# Altium schematic sheet Secondary Protection.SchDoc
size C
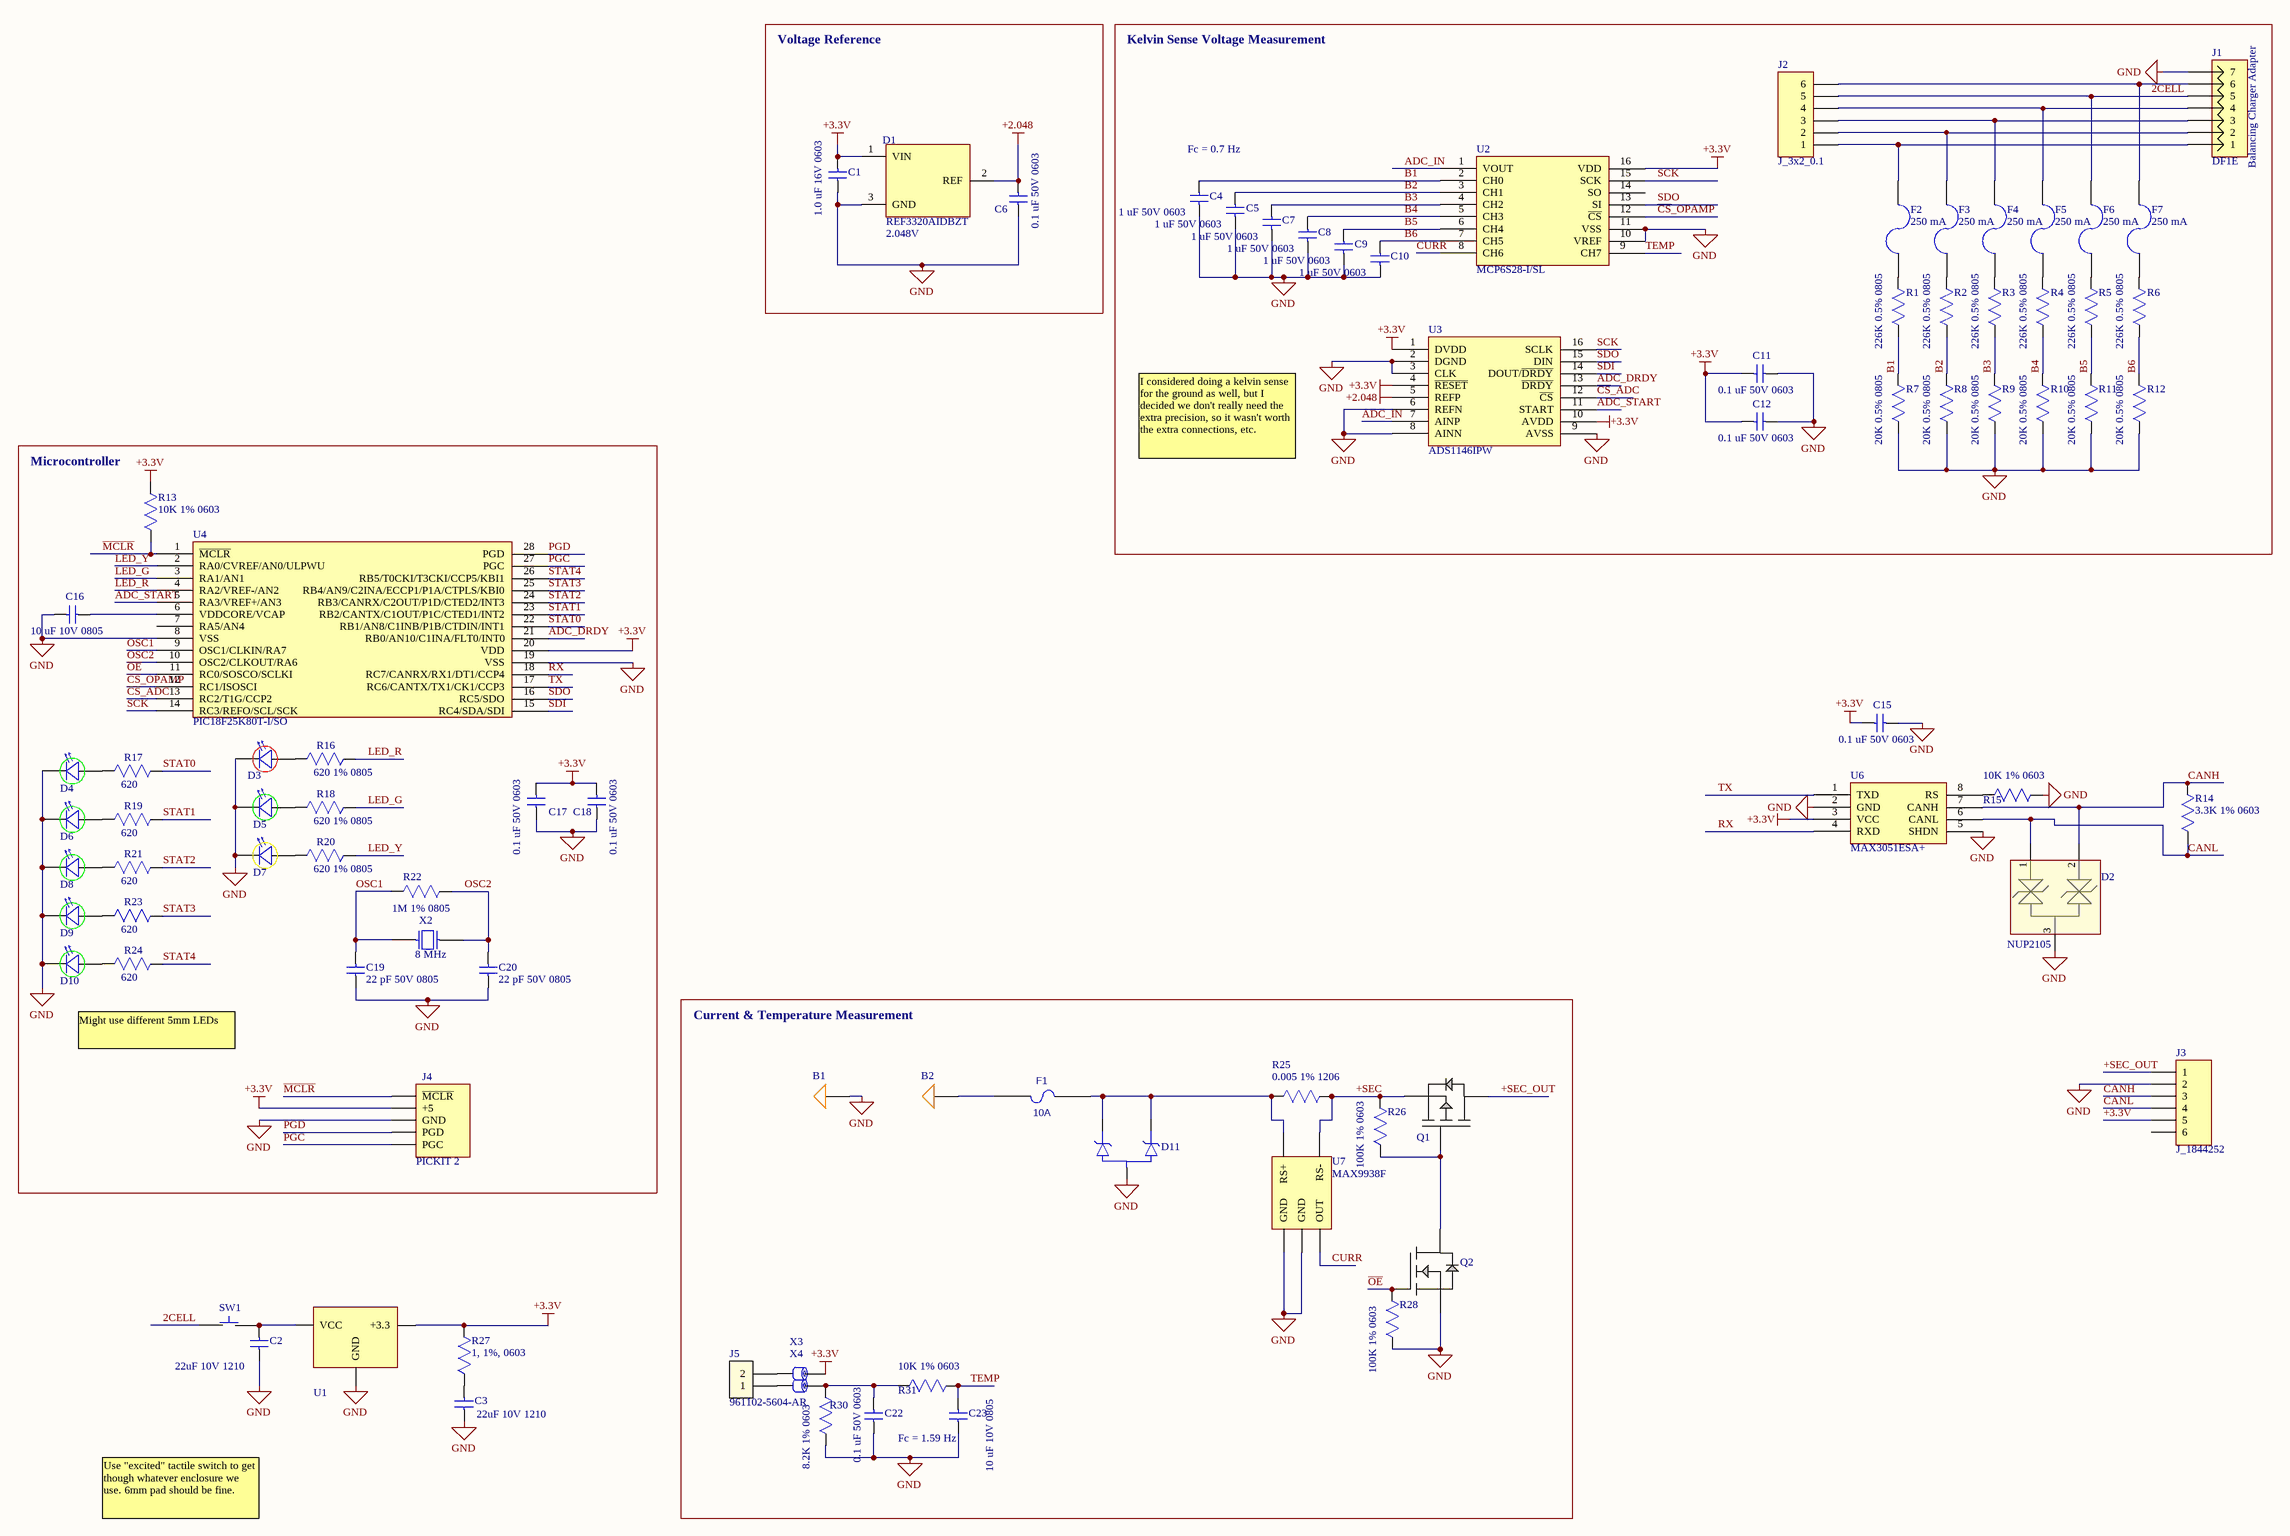
[diagram p0: Secondary Protection.SchDoc]

## Parts
B1  J_C3_BATTERY_PAD  [BatteryPad]  (value not drawn)
B2  J_C3_BATTERY_PAD  [BatteryPad]  (value not drawn)
C1  value 1.0 uF 16V 0603  [0603_cap]  (hidden comment: CAP 0603)
C2  value 22uF 10V 1210  [1210_Capacitor]  (hidden comment: CAP 1210)
C3  value 22uF 10V 1210  [1210_Capacitor]  (hidden comment: CAP 1210)
C4  value 1 uF 50V 0603  [0603_cap]  (hidden comment: CAP 0603)
C5  value 1 uF 50V 0603  [0603_cap]  (hidden comment: CAP 0603)
C6  value 0.1 uF 50V 0603  [0603_cap]  (hidden comment: CAP 0603)
C7  value 1 uF 50V 0603  [0603_cap]  (hidden comment: CAP 0603)
C8  value 1 uF 50V 0603  [0603_cap]  (hidden comment: CAP 0603)
C9  value 1 uF 50V 0603  [0603_cap]  (hidden comment: CAP 0603)
C10  value 1 uF 50V 0603  [0603_cap]  (hidden comment: CAP 0603)
C11  value 0.1 uF 50V 0603  [0603_cap]  (hidden comment: CAP 0603)
C12  value 0.1 uF 50V 0603  [0603_cap]  (hidden comment: CAP 0603)
C15  value 0.1 uF 50V 0603  [0603_cap]  (hidden comment: CAP 0603)
C16  value 10 uF 10V 0805  [0805_Capacitor]  (hidden comment: CAP 0805)
C17  value 0.1 uF 50V 0603  [0603_cap]  (hidden comment: CAP 0603)
C18  value 0.1 uF 50V 0603  [0603_cap]  (hidden comment: CAP 0603)
C19  value 22 pF 50V 0805  [0805_Capacitor]  (hidden comment: CAP 0805)
C20  value 22 pF 50V 0805  [0805_Capacitor]  (hidden comment: CAP 0805)
C22  value 0.1 uF 50V 0603  [0603_cap]  (hidden comment: CAP 0603)
C23  value 10 uF 10V 0805  [0805_Capacitor]  (hidden comment: CAP 0805)
D1  value 2.048V  Manufacturer PN: REF3320AIDBZT  [SOT-23]  (hidden comment: IC LDO V-REF 2.048V SOT23-3)
D2  Manufacturer PN: NUP2105  [SOT-23]  (hidden comment: CAN TVS)
D3  D_LED_0805_RED  [0805P_RED]  (value not drawn)
D4  D_LED_5MM_GREEN  [LED_5mm_GREEN]  (value not drawn)
D5  D_LED_0805_GREEN  [0805P_Green]  (value not drawn)
D6  D_LED_5MM_GREEN  [LED_5mm_GREEN]  (value not drawn)
D7  D_LED_0805_YELLOW  [0805P_YELLOW]  (value not drawn)
D8  D_LED_5MM_GREEN  [LED_5mm_GREEN]  (value not drawn)
D9  D_LED_5MM_GREEN  [LED_5mm_GREEN]  (value not drawn)
D10  D_LED_5MM_GREEN  [LED_5mm_GREEN]  (value not drawn)
D11  D_AZ23C36-TP  [SOT-23]  (value not drawn)
F1  value 10A  [FUSEHOLDER - AutoBlade]  (hidden comment: PWR - ATO 20A)
F2  250 mA  [1206_RESISTOR]
F3  250 mA  [1206_RESISTOR]
F4  250 mA  [1206_RESISTOR]
F5  250 mA  [1206_RESISTOR]
F6  250 mA  [1206_RESISTOR]
F7  250 mA  [1206_RESISTOR]
J1  value DF1E  [DF1EC-7P-2.5DSA]  (hidden comment: DF1E 5-pin Male Header)
J2  J_3x2_0.1  [6PIN_2_.100IN]
J3  J_1844252  [1844252]
J4  value PICKIT 2  [CONN FEMALE 5POS .100" R/A GOLD]  (hidden comment: J_PICKIT2_5)
J5  Manufacturer PN: 961102-5604-AR  [SIP_HEADER_2]  (hidden comment: J_Thermistor_Connector)
Q1  MOSFET P-CH 30V 25A TO-252  [DPAK]  (value not drawn)
Q2  RK7002BT116  [SOT-23]  (value not drawn)
R1  value 226K 0.5% 0805  [0805_Resistor]  (hidden comment: RES 0805)
R2  value 226K 0.5% 0805  [0805_Resistor]  (hidden comment: RES 0805)
R3  value 226K 0.5% 0805  [0805_Resistor]  (hidden comment: RES 0805)
R4  value 226K 0.5% 0805  [0805_Resistor]  (hidden comment: RES 0805)
R5  value 226K 0.5% 0805  [0805_Resistor]  (hidden comment: RES 0805)
R6  value 226K 0.5% 0805  [0805_Resistor]  (hidden comment: RES 0805)
R7  value 20K 0.5% 0805  [0805_Resistor]  (hidden comment: RES 0805)
R8  value 20K 0.5% 0805  [0805_Resistor]  (hidden comment: RES 0805)
R9  value 20K 0.5% 0805  [0805_Resistor]  (hidden comment: RES 0805)
R10  value 20K 0.5% 0805  [0805_Resistor]  (hidden comment: RES 0805)
R11  value 20K 0.5% 0805  [0805_Resistor]  (hidden comment: RES 0805)
R12  value 20K 0.5% 0805  [0805_Resistor]  (hidden comment: RES 0805)
R13  value 10K 1% 0603  [0603_res]  (hidden comment: RES 0603)
R14  value 3.3K 1% 0603  [0603_res]  (hidden comment: RES 0603)
R15  value 10K 1% 0603  [0603_res]  (hidden comment: RES 0603)
R16  value 620 1% 0805  [0805_Resistor]  (hidden comment: R_0805_620_1%)
R17  value 620  [0805_Resistor]  (hidden comment: R_0805_620_1%)
R18  value 620 1% 0805  [0805_Resistor]  (hidden comment: R_0805_620_1%)
R19  value 620  [0805_Resistor]  (hidden comment: R_0805_620_1%)
R20  value 620 1% 0805  [0805_Resistor]  (hidden comment: R_0805_620_1%)
R21  value 620  [0805_Resistor]  (hidden comment: R_0805_620_1%)
R22  value 1M 1% 0805  [0805_Resistor]  (hidden comment: RES 0805)
R23  value 620  [0805_Resistor]  (hidden comment: R_0805_620_1%)
R24  value 620  [0805_Resistor]  (hidden comment: R_0805_620_1%)
R25  value 0.005 1% 1206  [1206_Resistor]  (hidden comment: R_0805_0.01_1%)
R26  value 100K 1% 0603  [0603_res]  (hidden comment: RES 0603)
R27  value 1, 1%, 0603  [0603_res]  (hidden comment: RES 0603)
R28  value 100K 1% 0603  [0603_res]  (hidden comment: RES 0603)
R30  value 8.2K 1% 0603  [0603_res]  (hidden comment: RES 0603)
R31  value 10K 1% 0603  [0603_res]  (hidden comment: RES 0603)
SW1  SW_TACT_SWITCH_6x6  [TACT_SWITCH_6x6]  (value not drawn)
U1  MC7805BDTG  [DPAK]  (value not drawn)
U2  Manufacturer PN: MCP6S28-I/SL  [SOIC127P600X175-16N]  (hidden comment: U_MCP6S28-I/SL)
U3  U_ADS1146IPW  [ADS1146IPW]  (value not drawn)
U4  Manufacturer PN: PIC18F25K80T-I/SO  [SOIC127P1030X265-28N]  (hidden comment: PIC18F25K80)
U6  Manufacturer PN: MAX3051ESA+  [SOIC127P600X175-8N]  (hidden comment: U_MAX3051)
U7  value MAX9938F  [SOT95P280X145-5N]  (hidden comment: U_ MAX9938F)
X2  value 8 MHz  [HC-49]  (hidden comment: HC49)
X3  0603  [0603_res]  (value not drawn)
X4  0603  [0603_res]  (value not drawn)

## Blocks framed on the sheet
Voltage Reference: C1 C6 D1
Kelvin Sense Voltage Measurement: C4 C5 C7-C12 F2-F7 J1 J2 R1-R12 U2 U3
Microcontroller: C16-C20 D3-D10 J4 R13 R16-R24 U4 X2
Current & Temperature Measurement: B1 B2 C22 C23 D11 F1 J5 Q1 Q2 R25 R26 R28 R30 R31 U7 X3 X4

## Nets
+2.048: C6.1 D1.2(REF) U3.5(REFP)
+3.3V: C1.1 C11.2 C12.2 C15.1 C17.1 C18.1 D1.1(VIN) J3.5 J4.+5 R13.1 R27.1 U1.1(+3.3) U2.16(VDD) U3.1(DVDD) U3.4(~{RESET}) U3.10(AVDD) U4.20(VDD) U6.3(VCC) X3.2
GND: B1.1 C1.2 C2.2 C3.2 C4.1 C5.1 C6.2 C7.1 C8.1 C9.1 C10.1 C11.1 C12.1 C15.2 C16.2 C17.2 C18.2 C19.2 C20.2 C22.2 C23.2 D1.3(GND) D2.3 D3.1(Cathode) D4.1(Cathode) D5.1(Cathode) D6.1(Cathode) D7.1(Cathode) D8.1(Cathode) D9.1(Cathode) D10.1(Cathode) D11.3(ANODE) J1.7 J3.2 J4.GND Q2.2(SOURCE) R7.2 R8.2 R9.2 R10.2 R11.2 R12.2 R15.1 R28.2 R30.2 U1.3(GND) U2.10(VREF) U2.11(VSS) U3.2(DGND) U3.3(CLK) U3.6(REFN) U3.8(AINN) U3.9(AVSS) U4.8(VSS) U4.19(VSS) U6.2(GND) U6.5(SHDN) U7.1(GND) U7.2(GND)
2CELL: F6.2 J1.5 J2.5 SW1.1
+SEC: Q1.2(SOURCE) R25.1 R26.1 U7.4(RS-)
+SEC_OUT: J3.1 Q1.1(DRAIN)
ADC_DRDY: U3.13(~{DRDY}) U4.21(RB0/AN10/C1INA/FLT0/INT0)
ADC_IN: U2.1(VOUT) U3.7(AINP)
ADC_START: U3.11(START) U4.5(RA3/VREF+/AN3)
B1: C4.2 R1.2 R7.1 U2.2(CH0)
B2: C5.2 R2.2 R8.1 U2.3(CH1)
B3: C7.2 R3.2 R9.1 U2.4(CH2)
B4: C8.2 R4.2 R10.1 U2.5(CH3)
B5: C9.2 R5.2 R11.1 U2.6(CH4)
B6: C10.2 R6.2 R12.1 U2.7(CH5)
~{CS}_ADC: U3.12(~{CS}) U4.13(RC2/T1G/CCP2)
~{CS}_OPAMP: U2.12(~{CS}) U4.12(RC1/ISOSCI)
CANH: D2.2 J3.3 R14.1 U6.7(CANH)
CANL: D2.1 J3.4 R14.2 U6.6(CANL)
CURR: U2.8(CH6) U7.3(OUT)
LED_G: R18.1 U4.3(RA1/AN1)
LED_R: R16.1 U4.4(RA2/VREF-/AN2)
LED_Y: R20.1 U4.2(RA0/CVREF/AN0/ULPWU)
~{MCLR}: J4.RST(~{MCLR}) R13.2 U4.1(~{MCLR})
~{OE}: Q2.1(GATE) R28.1 U4.11(RC0/SOSCO/SCLKI)
OSC1: C19.1 R22.2 U4.9(OSC1/CLKIN/RA7) X2.2
OSC2: C20.1 R22.1 U4.10(OSC2/CLKOUT/RA6) X2.1
PGC: J4.PGC U4.27(PGC)
PGD: J4.PGD U4.28(PGD)
RX: U4.18(RC7/CANRX/RX1/DT1/CCP4) U6.4(RXD)
SCK: U2.15(SCK) U3.16(SCLK) U4.14(RC3/REFO/SCL/SCK)
SDI: U3.14(DOUT/~{DRDY}) U4.15(RC4/SDA/SDI)
SDO: U2.13(SI) U3.15(DIN) U4.16(RC5/SDO)
STAT0: R17.1 U4.22(RB1/AN8/C1INB/P1B/CTDIN/INT1)
STAT1: R19.1 U4.23(RB2/CANTX/C1OUT/P1C/CTED1/INT2)
STAT2: R21.1 U4.24(RB3/CANRX/C2OUT/P1D/CTED2/INT3)
STAT3: R23.1 U4.25(RB4/AN9/C2INA/ECCP1/P1A/CTPLS/KBI0)
STAT4: R24.1 U4.26(RB5/T0CKI/T3CKI/CCP5/KBI1)
TEMP: C23.1 R31.1 U2.9(CH7)
TX: U4.17(RC6/CANTX/TX1/CK1/CCP3) U6.1(TXD)
NetB2_1: B2.1 F1.2
NetC2_1: C2.1 SW1.2 U1.2(VCC)
NetC3_1: C3.1 R27.2
NetC16_1: C16.1 U4.6(VDDCORE/VCAP)
NetC22_1: C22.1 R30.1 R31.2 X4.2
NetD3_2: D3.2(Anode) R16.2
NetD4_2: D4.2(Anode) R17.2
NetD5_2: D5.2(Anode) R18.2
NetD6_2: D6.2(Anode) R19.2
NetD7_2: D7.2(Anode) R20.2
NetD8_2: D8.2(Anode) R21.2
NetD9_2: D9.2(Anode) R23.2
NetD10_2: D10.2(Anode) R24.2
NetD11_1: D11.1(CATHODE_1) D11.2(CATHODE_2) F1.1 R25.2 U7.5(RS+)
NetF2_1: F2.1 R1.1
NetF2_2: F2.2 J1.1 J2.1
NetF3_1: F3.1 R2.1
NetF3_2: F3.2 J1.2 J2.2
NetF4_1: F4.1 R3.1
NetF4_2: F4.2 J1.3 J2.3
NetF5_1: F5.1 R4.1
NetF5_2: F5.2 J1.4 J2.4
NetF6_1: F6.1 R5.1
NetF7_1: F7.1 R6.1
NetF7_2: F7.2 J1.6 J2.6
NetJ5_1: J5.1 X4.1
NetJ5_2: J5.2 X3.1
NetQ1_3: Q1.3(GATE) Q2.3(DRAIN) R26.2
NetR15_2: R15.2 U6.8(RS)

Not connected (* = marked no-connect by the designer): F1 3 4; J3 6; U2 14(SO); U4 7(RA5/AN4)

## Notes on the sheet
- Fc = 0.7 Hz
- (near J1) Balancing Charger Adapter
- I considered doing a kelvin sense for the ground as well, but I decided we don't really need the extra precision, so it wasn't worth the extra connections, etc.
- Might use different 5mm LEDs
- (near C23) Fc = 1.59 Hz
- Use "excited" tactile switch to get though whatever enclosure we use. 6mm pad should be fine.

## Library data of the parts
C1 = C_0603: CAP CER 1UF 16V 10% X7R 0603; Manufacturer: Taiyo Yuden; Manufacturer PN: EMK107B7105KA-T; Distributor: Digikey
C2 C3 = C_1210: CAP CER 22UF 10V 10% X7R 1210; Manufacturer: TDK Corporation; Manufacturer PN: C3225X7R1A226K/2.30; Distributor: Digikey
C4 C5 C7-C10 = C_0603: CAP CER 1UF 50V 10% X7R 0603; Distributor: Digikey
C6 C11 C12 C15 C17 C18 C22 = C_0603: CAP CER 0.1UF 50V 10% X7R 0603; Manufacturer: Yaego; Manufacturer PN: CC0603KRX7R9BB104; Distributor: Digikey
C16 C23 = C_0805: CAP CER 10UF 10V 10% X5R 0805; Manufacturer: Taiyo Yuden; Manufacturer PN: LMK212BJ106KG-T; Distributor: Digikey
C19 C20 = C_0805: CAP CER 22PF 50V 5% NP0 0805; Manufacturer: Johanson Dielectrics Inc; Manufacturer PN: 500R15N220JV4T; Distributor: Digikey
D1 = D_REF3320AIDBZT: Manufacturer: TI; Distributor: Digi-Key
D2 = D_NUP2105: IC CAN BUS PROTECTOR DUAL SOT23; Manufacturer: ON Semiconductor; Distributor: Digikey
D3 = D_LED_0805_RED: LED 2X1.2MM 625NM RD WTR CLR SMD 0805; Manufacturer: Kingbright Corp; Manufacturer PN: APT2012EC; Distributor: Digikey
D4 D6 D8-D10 = D_LED_5MM_GREEN: LED 5MM GREEN CLEAR 527NM 15DEG; pin to pad: 1>2 2>1; Manufacturer: Cree Inc; Manufacturer PN: C503B-GAN-CB0F0791; SVP Creator: Matt Crane; Current: 20mA; Forward Voltage: 3.2; Package: Radial; Known Distributors: Digikey; Value: GREEN; ComponentLink1Description: Datasheet
D5 = D_LED_0805_GREEN: LED 2X1.2MM 568NM GN WTR CLR SMD 0805; Manufacturer: Kingbright Corp; Manufacturer PN: APT2012SGC; Distributor: Digikey
D7 = D_LED_0805_YELLOW: LED 2X1.2MM 588NM YW WTR CLR SMD 0805; Manufacturer: Kingbright Corp; Manufacturer PN: APT2012YC; Distributor: Digikey
D11 = D_AZ23C36-TP: DIODE ZENER DUAL 36V SOT-23; Manufacturer: Micro; SVP Creator: Jonathan Nutzmann; Package: SOT-23-3; Known Distributors: Digikey; Manufacturer PN: AZ23C36-TP; HelpURL: http://umnsvp.dyndns.org/svn/centaurus2/datasheets/; ComponentLink1URL: http://umnsvp.dyndns.org/svn/centaurus2/datasheets/; ComponentLink1Description: Datasheet
F1 = FUSEHOLDER AutoBlade: FUSE HOLDER ATO AUTO BLADE; Part Number: 3550-2; Manufacturer: KEYSTONE/EQUIV.
F2-F7 = F_250mA_1206: FUSE 250 mA 1206; SVN Creator: Jonathan Nutzmann; SVN Reviewer 2: *; Package: 1206
J1 = DF1E_7_S: 7-pin Hirose; Manufacturer: Hirose Electric Co Ltd; Manufacturer PN: DF1EC-7P-2.5DSA(05); SVP Creator: Adam Shea; Package: DF1EC-7; Known Distributors: Digikey; HelpURL: http://umnsvp.dyndns.org/svn/centaurus2/datasheets/common%20parts/DF1E.pdf; ComponentLink1URL: http://umnsvp.dyndns.org/svn/centaurus2/datasheets/common%20parts/DF1E.pdf; ComponentLink1Description: Datasheet
J2 = J_3x2_0.1: 3 x 2 0.1" Header
J3 = J_1803316: CONN HEADER RT ANG 6POS 3.5MM; Manufacturer: Phoenix Contact; Manufacturer PN: 1844252
J4 = J_PICKIT2_5: PICKIT2 PROG HEADER; Manufacturer: Sullins Connector Solutions; Manufacturer PN: PPPC051LGBN-RC; Distributor: Digikey
J5 = J_Thermistor_Connector: Thermistor Connector; Manufacturer: 3M; Distributor: Digikey
Q1 = Q_AOD417_ P-CH_-30A_-25A_DPAK: MOSFET P-CH 30V 25A TO-252 DPAK; Manufacturer: Alpha & Omega Semiconductor Inc; Manufacturer PN: AOD417; SVP Creator: Brittany Pentek; SVP Reviewer 1: Brett Paulsen; Package: TO-252, (D-Pak); Known Distributors: Digikey; ComponentLink1URL: http://search.digikey.com/scripts/DkSearch/dksus.dll?Detail&name=785-1106-1-ND; ComponentLink1Description: http://www.aosmd.com/res/data_sheets/AOD417.pdf; HelpURL: http://search.digikey.com/scripts/DkSearch/dksus.dll?Detail&name=785-1106-1-ND; Price: 0.59
Q2 = Q_N_60V_250MA_SOT23: MOSFET N-CH 60V 250MA SOT-23; Manufacturer: Rohm Semiconductor; SVP Creator: Jonathan Nutzmann; Package: SOT-23-3; Known Distributors: Digikey; Manufacturer PN: RK7002BT116; Price: .13@25; ComponentLink1Description: Datasheet
R1-R6 = R_0805: RESISTOR, 1/10W, 226K, 0.5%, 0805; Manufacturer: Susumu; Manufacturer PN: RR1220P-2263-D-M; Known Distributors: Digikey; Package: 0805
R7-R12 = R_0805: RESISTOR, 1/10W, 20K, 0.5%, 0805; Manufacturer: Susumu; Manufacturer PN: RR1220P-203-D; Known Distributors: Digikey; Package: 0805
R13 R15 R31 = R_0603: RESISTOR, 1/10W, 10K, 1%, 0603; Manufacturer: ANY / EQUIV; Known Distributors: Digikey
R14 = R_0603: RESISTOR, 1/10W, 3.3K, 1%, 0603; Manufacturer: ANY / EQUIV; Known Distributors: Digikey
R16 R18 R20 = R_0805_620_1%: RESISTOR, 1/8W, 620, 1%, 0805; Manufacturer: ANY / EQUIV; Distributor: Digikey
R17 R19 R21 R23 R24 = R_0805_620_1%: RES 620 OHM 1/8W 1% 0805 SMD; Power Rating: .125W; SVP Creator: Jonathan Nutzmann; Package: 0805; Known Distributor: Digikey; ComponentLink1Description: Datasheet
R22 = R_0805: RESISTOR, 1/8W, 1M, 1%, 0805; Manufacturer: ANY / EQUIV; Known Distributors: Digikey; Package: 0805
R25 = R_0805_0.01_1%: RES CURRENT SENSE .005 OHM 1W 1%; Manufacturer PN: Ohmite; Manufacturer: MCS1632R010FER; Distributor: Digikey
R26 R28 = R_0603: RESISTOR, 1/10W, 500K, 1%, 0603; Manufacturer: ANY / EQUIV; Known Distributors: Digikey
R27 = R_0603: Known Distributors: Digikey; Package: 0603
R30 = R_0603: RESISTOR, 1/10W, 8.2K, 1%, 0603; Manufacturer: ANY / EQUIV; Distributor: Digikey
SW1 = SW_TACT_SWITCH_6x6: SWITCH TACT 6MM BLACK 160GF; Manufacturer: Tyco Electronics; Manufacturer PN: FSM8JH; SVP Creator: Nate Bolyard; Known Distributors: Digikey; Package: 6mm x 6mm
U1 = U_AP1117D33G_1: IC REG LDO BIPO 1A 3.3V TO252-3; Manufacturer: Diodes Inc; Manufacturer PN: AP1117D33G-13; SVP Creator: Thomas Daede; Known Distributors: Digikey; ComponentLink1Description: Datasheet; ComponentLink1URL: SVN Datasheet URL; Price: 0.63
U2 = U_MCP6S28-I/SL: IC PGA 8CH R-R I/O 16SOIC; Manufacturer: Microchip
U3 = U_ADS1146IPW: IC ADC 16BIT SRL 2KSPS 16TSSOP; Manufacturer: Texas Instruments; Manufacturer PN: ADS1146IPW
U4 = U_PIC18F25K80: MCU PIC 32KB FLASH 28SOIC; Manufacturer: Microchip; Distributor: Microchip Donation
U6 = U_MAX3051: IC TXRX CAN 1MBPS 8-SOIC 3.3V; Manufacturer: Maxim; Distributor: Digikey
U7 = U_ MAX9938F: IC AMP CURRENT SENSE SOT23-5; Manufacturer: Maxim; Manufacturer PN: MAX9938FEUK+T; Gain: 50; Distributor: Digikey
X2 = X_HC49: CRYSTAL 8.00 MHZ 20PF 49US; Manufacturer: ECS; Manufacturer PN: ECS-80-20-4X; Distributor: Digikey/Shop?
X3 X4 = X_0603_FERRITE: FERRITE CHIP 2A 300 OHM SMD; Manufacturer: Laird-Signal Integrity Products; Manufacturer PN: MI0603L301R-10; Value: 300 Ohm @ 100MHz; Distributor: Digikey; Package: 0603
B1 B2 = J_C3_BATTERY_PAD: ComponentLink1Description: Datasheet
  B1: Distributor: n/a
  B2: HelpURL: n/a